# Altium schematic sheet node_sch.SchDoc: Node
size A3; DrawnBy: VB; Revision: 1.1; SheetNumber: 2; SheetTotal: 2
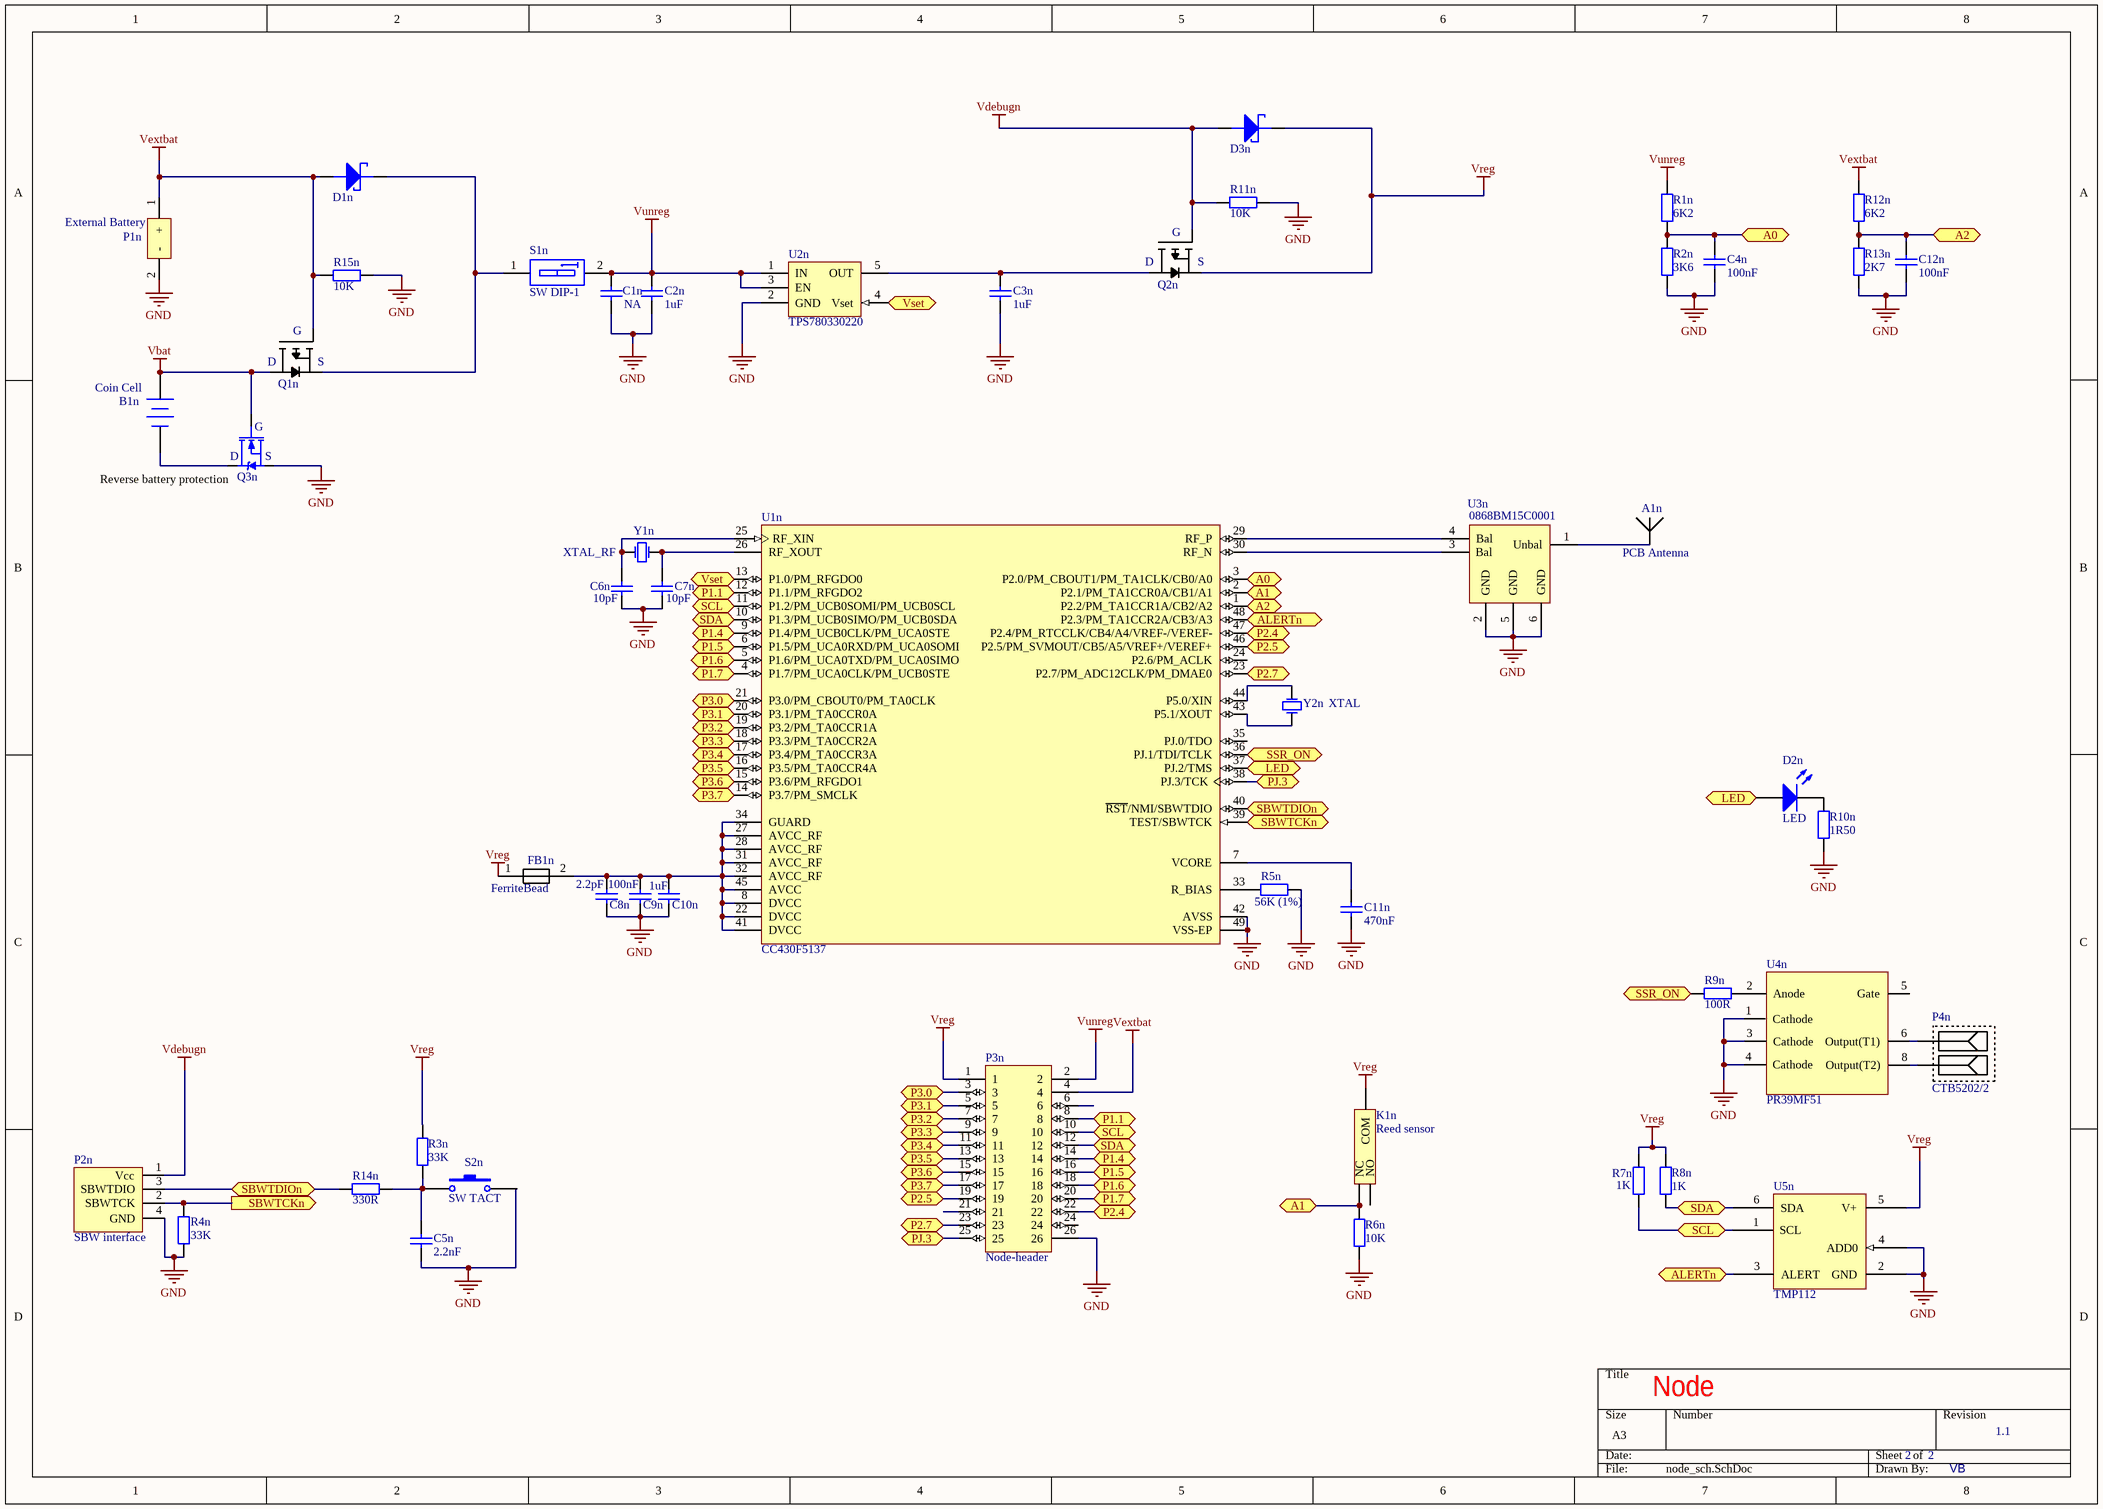
[diagram p0: node_sch.SchDoc]

## Parts
A1n  PCB Antenna  [TI_Monopole_PCB_Antenna]
B1n  Coin Cell  [COIN_CELL_HOLDER_JBH24]
C1n  NA  [0805_CAP]
C2n  1uF  [0805_CAP]
C3n  1uF  [0805_CAP]
C4n  100nF  [0805_CAP]
C5n  2.2nF  [0805_CAP]
C6n  10pF  [0805_CAP]
C7n  10pF  [0805_CAP]
C8n  2.2pF  [0805_CAP]
C9n  100nF  [0805_CAP]
C10n  1uF  [0805_CAP]
C11n  470nF  [0805_CAP]
C12n  100nF  [0805_CAP]
D1n  Schottky  [SOD323-F]  (value not drawn)
D2n  LED  [0805_LED_RED]
D3n  Schottky  [SOD323-F]  (value not drawn)
FB1n  FerriteBead  [0805_RES]
K1n  Reed sensor  [REED_SENSOR_SMD]
P1n  External Battery  [DF3A-2P-2DS]
P2n  SBW interface  [DF3A-4P-2DS]
P3n  Node-header  [FH26p2pitch_thru-hole]
P4n  CTB5202/2  [ScrewTerminal2p5pitch_thru-hole]
Q1n  Pin: D  Pin: G  Pin: S  [SOT23]  (hidden comment: P-MOS)
Q2n  Pin: S  Pin: D  Pin: G  [SOT23]  (hidden comment: P-MOS)
Q3n  pin: D  pin: S  pin: G  [SOT23]  (hidden comment: N-MOS)
R1n  6K2  [0805_RES]
R2n  3K6  [0805_RES]
R3n  33K  [0805_RES]
R4n  33K  [0805_RES]
R5n  56K (1%)  [0805_RES]
R6n  10K  [0805_RES]
R7n  1K  [0805_RES]
R8n  1K  [0805_RES]
R9n  100R  [0805_RES]
R10n  1R50  [0805_RES]
R11n  10K  [0805_RES]
R12n  6K2  [0805_RES]
R13n  2K7  [0805_RES]
R14n  330R  [0805_RES]
R15n  10K  [0805_RES]
S1n  SW DIP-1  [SW_DIP(1way)]
S2n  SW TACT  [SW-TACT]
U1n  CC430F5137  [TI-RGZ48-4100X4100TP_N]
U2n  TPS780330220  [SOT5]
U3n  0868BM15C0001  [JT_Balun]
U4n  PR39MF51  [SSR_SMT_LEAD]
U5n  TMP112  [SOT563]
Y1n  XTAL_RF  [xtal_rf]
Y2n  XTAL  [XTAL]

## Ports
A0 (bidir), A1 (bidir), A2 (bidir), ALERTn (bidir), LED (bidir), P1.1 (bidir), P1.4 (bidir), P1.5 (bidir), P1.6 (bidir), P1.7 (bidir), P2.4 (bidir), P2.5 (bidir), P2.7 (bidir), P3.0 (bidir), P3.1 (bidir), P3.2 (bidir), P3.3 (bidir), P3.4 (bidir), P3.5 (bidir), P3.6 (bidir), P3.7 (bidir), PJ.3 (bidir), SBWTCKn (out), SBWTDIOn (bidir), SCL (bidir), SDA (bidir), SSR_ON (bidir), Vset (bidir)

## Nets
GND: C1n.1 C2n.1 C3n.1 C4n.1 C5n.1 C6n.1 C7n.1 C8n.1 C9n.2 C10n.1 C11n.1 C12n.1 P1n.2(-) P2n.4(GND) P3n.26 Q3n.2(S) R2n.1 R4n.1 R5n.2 R6n.1 R10n.1 R11n.1 R13n.1 R15n.2 S2n.2 U1n.42(AVSS) U1n.49(VSS-EP) U2n.2(GND) U3n.2(GND) U3n.5(GND) U3n.6(GND) U4n.1(Cathode) U4n.3(Cathode) U4n.4(Cathode) U5n.2(GND) U5n.4(ADD0)
Vbat: B1n.1(+) Q1n.3(D) Q3n.1(G)
Vdebugn: D3n.2(ANODE) P2n.1(Vcc) Q2n.1(G) R11n.2
Vextbat: D1n.2(ANODE) P1n.1(+) P3n.4 Q1n.1(G) R12n.2 R15n.1
Vreg: D3n.1(CATHODE) FB1n.1 K1n.1(COM) P3n.1 Q2n.2(S) R3n.2 R7n.2 R8n.2 U5n.5(V+)
Vunreg: C1n.2 C2n.2 P3n.2 R1n.2 S1n.2(B1) U2n.1(IN) U2n.3(EN)
A0: C4n.2 R1n.1 R2n.2 U1n.3(P2.0/PM_CBOUT1/PM_TA1CLK/CB0/A0) ; port A0
A1: K1n.2(NC) R6n.2 U1n.2(P2.1/PM_TA1CCR0A/CB1/A1) ; port A1
A2: C12n.2 R12n.1 R13n.2 U1n.1(P2.2/PM_TA1CCR1A/CB2/A2) ; port A2
ALERTn: U1n.48(P2.3/PM_TA1CCR2A/CB3/A3) U5n.3(ALERT) ; port ALERTn
LED: D2n.1(A) U1n.37(PJ.2/TMS) ; port LED
P1.1: P3n.8 U1n.12(P1.1/PM_RFGDO2) ; port P1.1
P1.4: P3n.14 U1n.9(P1.4/PM_UCB0CLK/PM_UCA0STE) ; port P1.4
P1.5: P3n.16 U1n.6(P1.5/PM_UCA0RXD/PM_UCA0SOMI) ; port P1.5
P1.6: P3n.18 U1n.5(P1.6/PM_UCA0TXD/PM_UCA0SIMO) ; port P1.6
P1.7: P3n.20 U1n.4(P1.7/PM_UCA0CLK/PM_UCB0STE) ; port P1.7
P2.4: P3n.22 U1n.47(P2.4/PM_RTCCLK/CB4/A4/VREF-/VEREF-) ; port P2.4
P2.5: P3n.19 U1n.46(P2.5/PM_SVMOUT/CB5/A5/VREF+/VEREF+) ; port P2.5
P2.7: P3n.23 U1n.23(P2.7/PM_ADC12CLK/PM_DMAE0) ; port P2.7
P3.0: P3n.3 U1n.21(P3.0/PM_CBOUT0/PM_TA0CLK) ; port P3.0
P3.1: P3n.5 U1n.20(P3.1/PM_TA0CCR0A) ; port P3.1
P3.2: P3n.7 U1n.19(P3.2/PM_TA0CCR1A) ; port P3.2
P3.3: P3n.9 U1n.18(P3.3/PM_TA0CCR2A) ; port P3.3
P3.4: P3n.11 U1n.17(P3.4/PM_TA0CCR3A) ; port P3.4
P3.5: P3n.13 U1n.16(P3.5/PM_TA0CCR4A) ; port P3.5
P3.6: P3n.15 U1n.15(P3.6/PM_RFGDO1) ; port P3.6
P3.7: P3n.17 U1n.14(P3.7/PM_SMCLK) ; port P3.7
PJ.3: P3n.25 U1n.38(PJ.3/TCK) ; port PJ.3
SBWTCKn: P2n.2(SBWTCK) R4n.2 U1n.39(TEST/SBWTCK) ; port SBWTCKn
SBWTDIOn: P2n.3(SBWTDIO) R14n.1 U1n.40(~{RST}/NMI/SBWTDIO) ; port SBWTDIOn
SCL: P3n.10 R7n.1 U1n.11(P1.2/PM_UCB0SOMI/PM_UCB0SCL) U5n.1(SCL) ; port SCL
SDA: P3n.12 R8n.1 U1n.10(P1.3/PM_UCB0SIMO/PM_UCB0SDA) U5n.6(SDA) ; port SDA
SSR_ON: R9n.1 U1n.36(PJ.1/TDI/TCLK) ; port SSR_ON
Vset: U1n.13(P1.0/PM_RFGDO0) U2n.4(Vset) ; port Vset
NetA1n_1: A1n.1(ANT) U3n.1(Unbal)
NetB1n_2: B1n.2(-) Q3n.3(D)
NetC3n_2: C3n.2 Q2n.3(D) U2n.5(OUT)
NetC5n_2: C5n.2 R3n.1 R14n.2 S2n.1
NetC6n_2: C6n.2 U1n.25(RF_XIN) Y1n.1(OSC1)
NetC7n_2: C7n.2 U1n.26(RF_XOUT) Y1n.3(OSC2)
NetC8n_2: C8n.2 C9n.1 C10n.2 FB1n.2 U1n.8(DVCC) U1n.22(DVCC) U1n.27(AVCC_RF) U1n.28(AVCC_RF) U1n.31(AVCC_RF) U1n.32(AVCC_RF) U1n.34(GUARD) U1n.41(DVCC) U1n.45(AVCC)
NetC11n_2: C11n.2 U1n.7(VCORE)
NetD1n_1: D1n.1(CATHODE) Q1n.2(S) S1n.1(A1)
NetD2n_2: D2n.2(K) R10n.2
NetP4n_1: P4n.1 U4n.8(Output(T2))
NetP4n_2: P4n.2 U4n.6(Output(T1))
NetR5n_1: R5n.1 U1n.33(R_BIAS)
NetR9n_2: R9n.2 U4n.2(Anode)
NetU1n_29: U1n.29(RF_P) U3n.4(Bal)
NetU1n_30: U1n.30(RF_N) U3n.3(Bal)
NetU1n_43: U1n.43(P5.1/XOUT) Y2n.1(OSC1)
NetU1n_44: U1n.44(P5.0/XIN) Y2n.2(OSC2)

Not connected (* = marked no-connect by the designer): K1n 3(NO); P3n 6 21 24; U1n 24(P2.6/PM_ACLK) 35(PJ.0/TDO); U4n 5(Gate)

## Notes on the sheet
- (near Q3n) Reverse battery protection

## Library data of the parts
A1n = PCB-Antenna: TI Monopole PCB Antenna at 868MHz operating frequency; Details: Low cost, medium size PCB antenna solution by Texas Instruments. See details: DN024 de
B1n = Coin_Cell: Represents a 24,5mm diameter coin cell battery (holder); Supplier: Farnell: 1365934; Type: JBH24
C1n C2n C3n C4n C5n C6n C7n C8n C10n C12n = Capacitor
  C1n: Value: NA
  C2n C3n C10n: Value: 1uF
  C4n C12n: Value: 100nF
  C5n: Value: 2.2nF
  C6n C7n: Value: 10pF
  C8n: Value: 2.2pF
C9n C11n = CAP: Capacitor
  C9n: Value: 100nF
  C11n: Value: 470nF
D1n D3n = Schottky: NXP - 1PS76SB10, SCHOTTKY RECT 30V 0.2A SOD323; Supplier: Lomex 83-02-04
D2n = LED: Typical GaAs LED
FB1n = FerriteBead: Ferrite Bead
K1n = Reed-Sensor: Reed sensor for proximity sensing; Type/Supplier: ORT551 / lomex: 42-01-87; Type/Supplier: MK15-B-2-OE  / 1079484
P1n = ExtBatConnector: Simple 2 trhu-hole connection for extra batteries
P2n = SBW-interface: 4 pole connector for debugging and programming; Supplier: Farnell: 1711329; Type: MOLEX - 87438-0443
P3n = Node-header: Female Header of the node pi 13x2 GPIO connector
P4n = CTB5202/2: 2 Pole Screw Terminal; Supplier: Farnell: 1717001
Q1n Q2n = P-MOS: irlml6401, P CH, -12V, 4A, SOT23; Supplier: Ebay
Q3n = N-MOS: FDV301N, N CH, 25V, 0.22A, SOT23; Supplier: Lomex: 86-03-44
R1n R2n R3n R4n R5n R6n R7n R8n R9n R12n R13n = RES: Resistor
  R1n R12n: Value: 6K2
  R2n: Value: 3K6
  R3n R4n: Value: 33K
  R5n: Value: 56K (1%)
  R6n: Value: 10K
  R7n R8n: Value: 1K
  R9n: Value: 100R
  R13n: Value: 2K7
R10n R11n R14n R15n = Resistor
  R10n: Value: 1R50
  R11n R15n: Value: 10K
  R14n: Value: 330R
S1n = SW DIP-1: DIP Switch, 1 Position; PackageReference: DIP-1 pole; Supplier: Farnell: 1960892
S2n = SW-TACT: Low profile, miniature tact switch; PackageDescription: Switch; 2 Leads; Supplier: Farnell: 1633006
U1n = CC430F5137IRGZR: 20 MHz MSP430 SoC with RF Core with 32 KB Flash, 4096 B SRAM and 30 GPIOs, -40 to 85 degC, 48-pin QFN (RGZ), Green (RoHS & no Sb/Br); Manufacturer: Texas Instruments; ADC: Yes; ADC Channels: 6; DMA: 3; Flash(KB): 32; Frequency(MHz): 20; GPIO: 30; Multiplier: 32x32; SRAM(B): 4096; SubFamily: RF SoC Series; Timers - 16-bit: 2; USCI_A (UART/LIN/IrDA/SPI): 1; DatasheetVersion: SLAS554F; PackageVersion: 4204101/F; PackageReference: RGZ48-4100X4100TP; PackageDescription: 48-Pin Plastic Flat Pack, Body 7 x 7 mm, Pitch 0.5 mm; Supplier 1: Digi-Key; Supplier Part Number 1: 296-27420-2-ND; Supplier 2: Digi-Key; Supplier Part Number 2: 296-27420-1-ND; Supplier 3: Digi-Key; Supplier Part Number 3: 296-27420-6-ND; Supplier 4: Newark; Supplier Part Number 4: 68R5912; Supplier 5: Mouser; Supplier Part Number 5: 595-CC430F5137IRGZR; Brown Out Reset: Yes; Comparators: Yes; Eco-Plan: Green (RoHS & no Sb/Br); Real-Time Clock: Yes; SVS: Yes; Temp Sensor: Yes; USCI_B (I2C & SPI): 1; Watchdog: Yes; Mounting Technology: Surface Mount; Code_JEDEC: MO-220; PartNumber: CC430F5137IRGZR; ComponentLink1Description: Manufacturer URL; ComponentLink1URL: http://www.ti.com/; ComponentLink2Description: Datasheet; ComponentLink2URL: http://www.ti.com/general/docs/lit/getliterature.tsp?genericPartNumber=CC430F5137&fileType=pdf; ComponentLink3Description: Package Specification; ComponentLink3URL: http://www.ti.com/lit/ds/symlink/sn75dp139.pdf; Supplier 6: TI Sample (CC430F5137IRGZR)
U2n = TPS780330220: LDO with 2.2V fix output; Vinput: 2.2 - 5.5V; Supplier: TI Sample
U3n = 0868BM15C0001: 868MHz Impedance Matched/Balun/BPF Integrated Component for T.I. CC110X, CC430, etc.; Manufacturer: Johanson Technology; PackageReference: 0805; Supplier 1: Farnell; Mounting Technology: Surface Mount; PartNumber: 0868BM15C0001
U4n = PR39MF51: PR39MF51 SSR, 1.2A; Supplier: Farnell: 1618487
U5n = TMP112: Temp sensor (serial interface, 0.5 C resolution, low supply voltage); Vcc range: 1.4 - 3.6V; Supplier: TI sample (TMP112AIDRLT)
Y1n = XTAL_RF: Crystal Oscillator; Published: 8-Jun-2000; LatestRevisionDate: 17-Jul-2002; LatestRevisionNote: Re-released for DXP Platform.; PackageReference: R38; Publisher: Altium Limited; PackageDescription: Crystal, Thru-Hole; 2 Leads; Body 3.1 x 8.2 mm (Dia.xH); Supplier: Farnell: 1841998  (26M); Supplier: Lomex: 40-02-49 (32768Hz)
Y2n = XTAL: Crystal Oscillator; Published: 8-Jun-2000; LatestRevisionDate: 17-Jul-2002; LatestRevisionNote: Re-released for DXP Platform.; PackageReference: R38; Publisher: Altium Limited; PackageDescription: Crystal, Thru-Hole; 2 Leads; Body 3.1 x 8.2 mm (Dia.xH); Supplier: Farnell: 1841998  (26M); Supplier: Lomex: 40-02-49 (32768Hz)